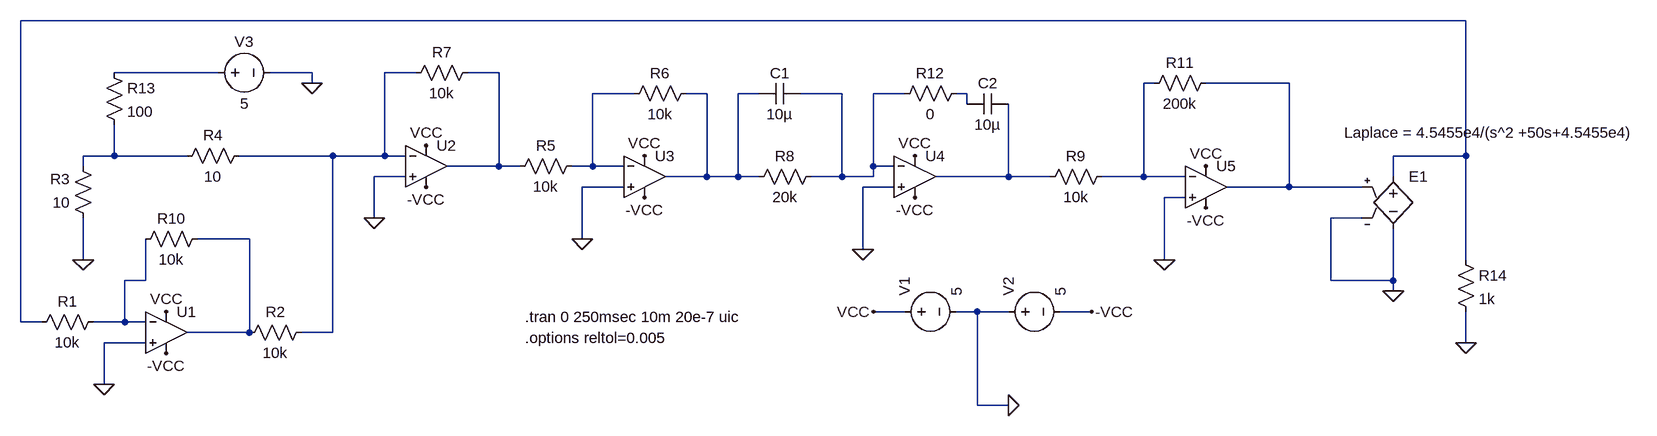
[diagram p0: schematic Circuito con Funcion de Transferencia.asc]
Circuito con Funcion de Transferencia.asc, the LTspice schematic file:
Version 4
SHEET 1 1580 680
WIRE 1264 -160 -960 -160
WIRE -656 -80 -816 -80
WIRE -512 -80 -576 -80
WIRE -352 -80 -400 -80
WIRE -224 -80 -272 -80
WIRE -512 -64 -512 -80
WIRE 784 -64 768 -64
WIRE 992 -64 864 -64
WIRE -16 -48 -80 -48
WIRE 96 -48 64 -48
WIRE 176 -48 144 -48
WIRE 304 -48 240 -48
WIRE 400 -48 352 -48
WIRE 496 -48 480 -48
WIRE 496 -32 496 -48
WIRE -816 48 -816 0
WIRE -816 48 -864 48
WIRE -704 48 -816 48
WIRE -480 48 -624 48
WIRE -400 48 -400 -80
WIRE -400 48 -480 48
WIRE -368 48 -400 48
WIRE 1264 48 1264 -160
WIRE 1264 48 1152 48
WIRE -864 64 -864 48
WIRE -224 64 -224 -80
WIRE -224 64 -304 64
WIRE -192 64 -224 64
WIRE -80 64 -80 -48
WIRE -80 64 -112 64
WIRE -32 64 -80 64
WIRE 352 64 352 -48
WIRE 384 64 352 64
WIRE -368 80 -416 80
WIRE 96 80 96 -48
WIRE 96 80 32 80
WIRE 144 80 144 -48
WIRE 144 80 96 80
WIRE 176 80 144 80
WIRE 304 80 304 -48
WIRE 304 80 256 80
WIRE 352 80 352 64
WIRE 352 80 304 80
WIRE 560 80 560 -32
WIRE 560 80 448 80
WIRE 624 80 560 80
WIRE 768 80 768 -64
WIRE 768 80 704 80
WIRE 832 80 768 80
WIRE 1152 80 1152 48
WIRE -32 96 -96 96
WIRE 384 96 336 96
WIRE 992 96 992 -64
WIRE 992 96 896 96
WIRE 1104 96 992 96
WIRE 832 112 800 112
WIRE -416 144 -416 80
WIRE 1104 144 1056 144
WIRE -608 176 -688 176
WIRE -96 176 -96 96
WIRE 336 192 336 96
WIRE -864 208 -864 144
WIRE 800 208 800 112
WIRE 1264 208 1264 48
WIRE -768 240 -768 176
WIRE -768 240 -800 240
WIRE 1056 240 1056 144
WIRE 1152 240 1152 160
WIRE 1152 240 1056 240
WIRE 1152 256 1152 240
WIRE 400 288 352 288
WIRE 512 288 480 288
WIRE 560 288 512 288
WIRE 688 288 640 288
WIRE -960 304 -960 -160
WIRE -928 304 -960 304
WIRE -800 304 -800 240
WIRE -800 304 -848 304
WIRE -768 304 -800 304
WIRE -608 320 -608 176
WIRE -608 320 -704 320
WIRE -480 320 -480 48
WIRE -480 320 -528 320
WIRE -768 336 -832 336
WIRE 1264 336 1264 288
WIRE -832 400 -832 336
WIRE 512 432 512 288
WIRE 560 432 512 432
FLAG 1264 336 0
FLAG 800 208 0
FLAG 336 192 0
FLAG -96 176 0
FLAG -832 400 0
FLAG -416 144 0
FLAG -336 32 VCC
FLAG -736 288 VCC
FLAG 0 48 VCC
FLAG 416 48 VCC
FLAG 864 64 VCC
FLAG -336 96 -VCC
FLAG -736 352 -VCC
FLAG 0 112 -VCC
FLAG 416 112 -VCC
FLAG 864 128 -VCC
FLAG 560 432 0
FLAG 352 288 VCC
FLAG 688 288 -VCC
FLAG -864 208 0
FLAG 1152 256 0
FLAG -512 -64 0
SYMBOL res -832 288 R90
WINDOW 0 0 56 VBottom 2
WINDOW 3 32 56 VTop 2
SYMATTR InstName R1
SYMATTR Value 10k
SYMBOL res -512 304 R90
WINDOW 0 0 56 VBottom 2
WINDOW 3 32 56 VTop 2
SYMATTR InstName R2
SYMATTR Value 10k
SYMBOL res -848 160 R180
WINDOW 0 36 76 Left 2
WINDOW 3 36 40 Left 2
SYMATTR InstName R3
SYMATTR Value 10
SYMBOL res -720 64 R270
WINDOW 0 32 56 VTop 2
WINDOW 3 0 56 VBottom 2
SYMATTR InstName R4
SYMATTR Value 10
SYMBOL res -208 80 R270
WINDOW 0 32 56 VTop 2
WINDOW 3 0 56 VBottom 2
SYMATTR InstName R5
SYMATTR Value 10k
SYMBOL res -32 -32 R270
WINDOW 0 32 56 VTop 2
WINDOW 3 0 56 VBottom 2
SYMATTR InstName R6
SYMATTR Value 10k
SYMBOL res -368 -64 R270
WINDOW 0 32 56 VTop 2
WINDOW 3 0 56 VBottom 2
SYMATTR InstName R7
SYMATTR Value 10k
SYMBOL res 160 96 R270
WINDOW 0 32 56 VTop 2
WINDOW 3 0 56 VBottom 2
SYMATTR InstName R8
SYMATTR Value 20k
SYMBOL cap 240 -64 R90
WINDOW 0 0 32 VBottom 2
WINDOW 3 32 32 VTop 2
SYMATTR InstName C1
SYMATTR Value 10µ
SYMBOL cap 560 -48 R90
WINDOW 0 0 32 VBottom 2
WINDOW 3 32 32 VTop 2
SYMATTR InstName C2
SYMATTR Value 10µ
SYMBOL res 720 64 R90
WINDOW 0 0 56 VBottom 2
WINDOW 3 32 56 VTop 2
SYMATTR InstName R9
SYMATTR Value 10k
SYMBOL res -672 160 R90
WINDOW 0 0 56 VBottom 2
WINDOW 3 32 56 VTop 2
SYMATTR InstName R10
SYMATTR Value 10k
SYMBOL res 880 -80 R90
WINDOW 0 0 56 VBottom 2
WINDOW 3 32 56 VTop 2
SYMATTR InstName R11
SYMATTR Value 200k
SYMBOL res 496 -64 R90
WINDOW 0 0 56 VBottom 2
WINDOW 3 32 56 VTop 2
SYMATTR InstName R12
SYMATTR Value 0
SYMBOL voltage 384 288 R270
WINDOW 123 0 0 Left 0
WINDOW 39 0 0 Left 0
SYMATTR InstName V1
SYMATTR Value 5
SYMBOL voltage 544 288 R270
WINDOW 123 0 0 Left 0
WINDOW 39 0 0 Left 0
SYMATTR InstName V2
SYMATTR Value 5
SYMBOL res -832 -96 R0
SYMATTR InstName R13
SYMATTR Value 100
SYMBOL OpAmps\\UniversalOpAmp2 -736 320 R0
SYMATTR InstName U1
SYMBOL OpAmps\\UniversalOpAmp2 -336 64 R0
SYMATTR InstName U2
SYMBOL OpAmps\\UniversalOpAmp2 0 80 R0
SYMATTR InstName U3
SYMBOL OpAmps\\UniversalOpAmp2 416 80 R0
SYMATTR InstName U4
SYMBOL OpAmps\\UniversalOpAmp2 864 96 R0
SYMATTR InstName U5
SYMBOL e 1152 64 R0
WINDOW 3 -75 -52 Left 2
SYMATTR Value Laplace = 4.5455e4/(s^2 +50s+4.5455e4)
SYMATTR InstName E1
SYMBOL res 1248 192 R0
SYMATTR InstName R14
SYMATTR Value 1k
SYMBOL voltage -672 -80 R270
WINDOW 0 32 56 VTop 2
WINDOW 3 -32 56 VBottom 2
WINDOW 123 0 0 Left 0
WINDOW 39 0 0 Left 0
SYMATTR InstName V3
SYMATTR Value 5
TEXT -184 296 Left 2 !.tran 0 250msec 10m 20e-7 uic
TEXT -184 328 Left 2 !.options reltol=0.005

The netlist it stands for:
* Circuito con Funcion de Transferencia.asc
R1 N014 N001 10k
R2 N003 N013 10k
R3 0 N011 10
R4 N011 N003 10
R5 N004 N007 10k
R6 N007 N008 10k
R7 N003 N004 10k
R8 N008 N009 20k
C1 N009 N008 10µ
C2 N012 N010 10µ
R9 N005 N012 10k
R10 N013 N014 10k
R11 N006 N005 200k
R12 N010 N009 0
V1 VCC 0 5
V2 0 -VCC 5
R13 N002 N011 100
XU1 0 N014 VCC -VCC N013 level2 Avol=1Meg GBW=10Meg Slew=10Meg Ilimit=25m Rail=0 Vos=0 En=0 Enk=0 In=0 Ink=0 Rin=500Meg  ; pins In+ In- V+ V- OUT
XU2 0 N003 VCC -VCC N004 level2 Avol=1Meg GBW=10Meg Slew=10Meg Ilimit=25m Rail=0 Vos=0 En=0 Enk=0 In=0 Ink=0 Rin=500Meg  ; pins In+ In- V+ V- OUT
XU3 0 N007 VCC -VCC N008 level2 Avol=1Meg GBW=10Meg Slew=10Meg Ilimit=25m Rail=0 Vos=0 En=0 Enk=0 In=0 Ink=0 Rin=500Meg  ; pins In+ In- V+ V- OUT
XU4 0 N009 VCC -VCC N012 level2 Avol=1Meg GBW=10Meg Slew=10Meg Ilimit=25m Rail=0 Vos=0 En=0 Enk=0 In=0 Ink=0 Rin=500Meg  ; pins In+ In- V+ V- OUT
XU5 0 N005 VCC -VCC N006 level2 Avol=1Meg GBW=10Meg Slew=10Meg Ilimit=25m Rail=0 Vos=0 En=0 Enk=0 In=0 Ink=0 Rin=500Meg  ; pins In+ In- V+ V- OUT
E1 N001 0 N006 0 Laplace = 4.5455e4/(s^2 +50s+4.5455e4)
R14 N001 0 1k
V3 N002 0 5
.tran 0 250msec 10m 20e-7 uic
.options reltol=0.005
.lib UniversalOpAmp2.lib
.backanno
.end